# Altium schematic sheet Sheet1.SchDoc
size A; SheetNumber: 1; SheetTotal: 1
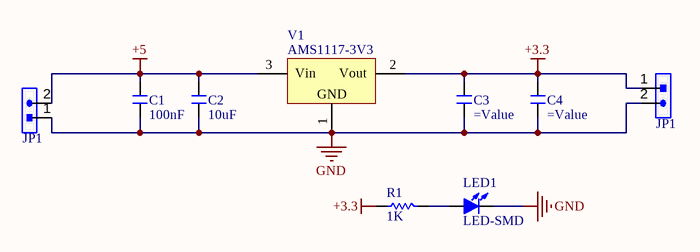
[diagram p0: Sheet1.SchDoc]

## Parts
(Parts that share a designator on the sheet are numbered #1, #2 ... from top to bottom, then left to right.)
C1  100nF  [C 0805]
C2  10uF  [C 0805]
C3  (no value)  [C 0805]
C4  (no value)  [C 0805]
JP1#1  HDR-1X2  [HDR-1X2]  (value not drawn)
JP1#2  HDR-1X2  [HDR-1X2]  (value not drawn)
LED1  LED-SMD  [LED 0805R]
R1  1K  [R 0805]
V1  AMS1117-3V3  [SOT223_L]

## Nets
+3.3: C3.2 C4.2 JP1#2.1 R1.1 V1.2(Vout)
+5: C1.2 C2.2 JP1#1.2 V1.3(Vin)
GND: C1.1 C2.1 C3.1 C4.1 JP1#1.1 JP1#2.2 LED1.2(K) V1.1(GND)
NetLED1_1: LED1.1(A) R1.2

## Library data of the parts
C1-C4 = C: Non-polar patch capacitor; BOM名称: 无极性贴片电容; 版权归属: 源创客; 学习资源: www.ooocke.com
JP1#1 JP1#2 = Header 2: 2P Connector; BOM名称: 2P接插件; 版权归属: 源创客; 学习资源: www.ooocke.com
LED1 = LED-SMD: Patch LED; BOM名称: 贴片LED; 版权归属: 源创客; 学习资源: www.ooocke.com
R1 = R: Chip resistor; 版权归属: 源创客; BOM名称: Chip resistor; 学习资源: www.ooocke.com
V1 = AMS1117: Three-terminal regulator chip; BOM名称: 稳压芯片; 版权归属: 源创客; 学习资源: www.ooocke.com